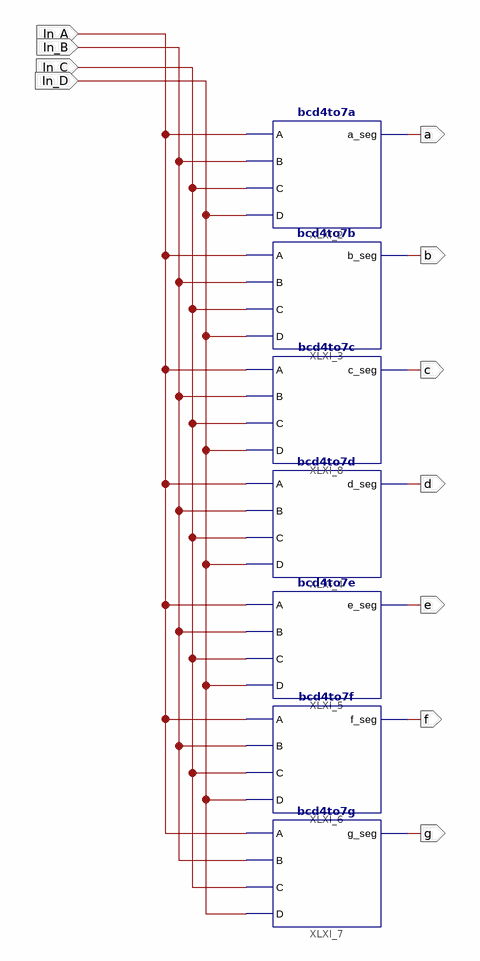
[diagram p0: schematic sheet 1]
// Xilinx ISE schematic bcd4to7.sch (spartan6) as structural Verilog: 7 symbols, 11 ports
module bcd4to7 (
  input  In_A,
  input  In_B,
  input  In_C,
  input  In_D,
  output a,
  output b,
  output c,
  output d,
  output e,
  output f,
  output g
);

  bcd4to7a XLXI_2 (.A(In_A), .B(In_B), .C(In_C), .D(In_D), .a_seg(a));
  bcd4to7b XLXI_3 (.A(In_A), .B(In_B), .C(In_C), .D(In_D), .b_seg(b));
  bcd4to7d XLXI_4 (.A(In_A), .B(In_B), .C(In_C), .D(In_D), .d_seg(d));
  bcd4to7e XLXI_5 (.A(In_A), .B(In_B), .C(In_C), .D(In_D), .e_seg(e));
  bcd4to7f XLXI_6 (.A(In_A), .B(In_B), .C(In_C), .D(In_D), .f_seg(f));
  bcd4to7g XLXI_7 (.A(In_A), .B(In_B), .C(In_C), .D(In_D), .g_seg(g));
  bcd4to7c XLXI_8 (.A(In_A), .B(In_B), .C(In_C), .D(In_D), .c_seg(c));
endmodule
